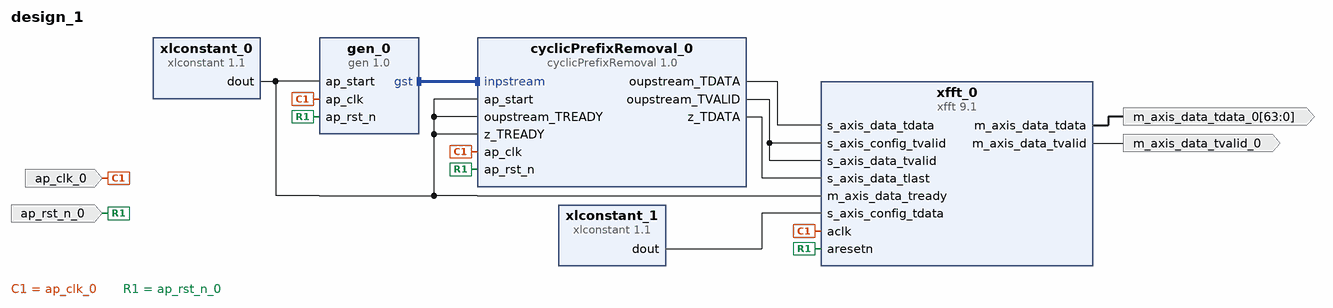
[diagram p0: block diagram of the top level]
# Vivado block design design_1, xc7z020clg484-1, Vivado 2022.2.2
create_bd_design design_1

create_bd_port -dir I -type clk ap_clk_0
create_bd_port -dir I -type rst ap_rst_n_0
create_bd_port -dir O -from 63 -to 0 m_axis_data_tdata_0
create_bd_port -dir O m_axis_data_tvalid_0

create_bd_cell -type ip -vlnv xilinx.com:hls:gen:1.0 gen_0
create_bd_cell -type ip -vlnv xilinx.com:ip:xlconstant:1.1 xlconstant_0
create_bd_cell -type ip -vlnv xilinx.com:ip:xfft:9.1 xfft_0
set_property -dict [list \
  CONFIG.aresetn true \
  CONFIG.data_format floating_point \
  CONFIG.implementation_options automatically_select \
  CONFIG.number_of_stages_using_block_ram_for_data_and_phase_factors 0 \
  CONFIG.output_ordering natural_order \
  CONFIG.phase_factor_width 24 \
  CONFIG.transform_length 8192 \
] [get_bd_cells xfft_0]
create_bd_cell -type ip -vlnv xilinx.com:ip:xlconstant:1.1 xlconstant_1
set_property -dict {CONFIG.CONST_WIDTH 16} [get_bd_cells xlconstant_1]
create_bd_cell -type ip -vlnv xilinx.com:hls:cyclicPrefixRemoval:1.0 cyclicPrefixRemoval_0

# ---- connections ----

connect_bd_intf_net [get_bd_intf_pins gen_0/gst] [get_bd_intf_pins cyclicPrefixRemoval_0/inpstream]
connect_bd_net -net ap_clk_0_1 [get_bd_ports ap_clk_0] [get_bd_pins gen_0/ap_clk] [get_bd_pins xfft_0/aclk] [get_bd_pins cyclicPrefixRemoval_0/ap_clk]
connect_bd_net -net ap_rst_n_0_1 [get_bd_ports ap_rst_n_0] \
  [get_bd_pins gen_0/ap_rst_n] [get_bd_pins xfft_0/aresetn] [get_bd_pins cyclicPrefixRemoval_0/ap_rst_n]
connect_bd_net [get_bd_pins cyclicPrefixRemoval_0/oupstream_TDATA] [get_bd_pins xfft_0/s_axis_data_tdata]
connect_bd_net [get_bd_pins cyclicPrefixRemoval_0/oupstream_TVALID] [get_bd_pins xfft_0/s_axis_data_tvalid] [get_bd_pins xfft_0/s_axis_config_tvalid]
connect_bd_net -net cyclicPrefixRemoval_0_z_write [get_bd_pins cyclicPrefixRemoval_0/z_TDATA] [get_bd_pins xfft_0/s_axis_data_tlast]
connect_bd_net [get_bd_pins xfft_0/m_axis_data_tdata] [get_bd_ports m_axis_data_tdata_0]
connect_bd_net [get_bd_pins xfft_0/m_axis_data_tvalid] [get_bd_ports m_axis_data_tvalid_0]
connect_bd_net [get_bd_pins xlconstant_0/dout] \
  [get_bd_pins gen_0/ap_start] [get_bd_pins xfft_0/m_axis_data_tready] [get_bd_pins cyclicPrefixRemoval_0/ap_start] \
  [get_bd_pins cyclicPrefixRemoval_0/oupstream_TREADY] [get_bd_pins cyclicPrefixRemoval_0/z_TREADY]
connect_bd_net [get_bd_pins xlconstant_1/dout] [get_bd_pins xfft_0/s_axis_config_tdata]

validate_bd_design
save_bd_design
